# Altium schematic sheet supply.SchDoc
size A; SheetNumber: 2; SheetTotal: 3
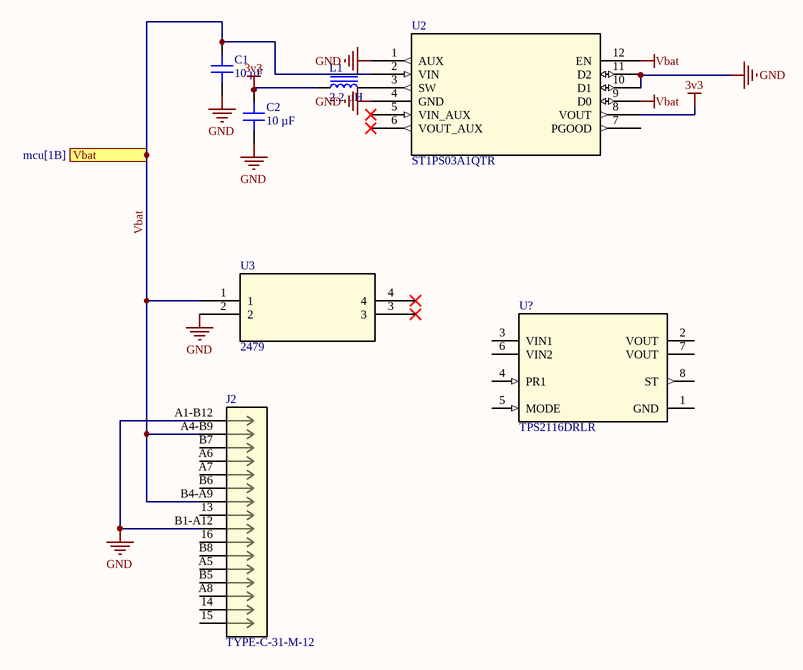
[diagram p0: supply.SchDoc]

## Parts
C1  10 µF  [CAP 0402_1005]
C2  10 µF  [CAP 0402_1005]
J2  TYPE-C-31-M-12  [CONN12_C-31-M-12_HRO]
L1  2.2 µH  [TDK VLS201612CX]
U2  ST1PS03A1QTR  [TQFN12_2X1P7_STM]
U3  2479  [2479PCB_37P49X52P63_KEY]
U?  TPS2116DRLR  [DRL0008A-MFG]

## Ports
Vbat (see mcu[1B])

## Nets
3v3: C2.1 L1.1 U2.8(VOUT)
GND: C1.2 C2.2 J2.A1-B12 J2.B1-A12 U2.1(AUX) U2.4(GND) U2.10(D1) U2.11(D2) U3.2
Vbat: C1.1 J2.A4-B9 J2.B4-A9 U2.2(VIN) U2.9(D0) U2.12(EN) U3.1 ; port Vbat
NetL1_2: L1.2 U2.3(SW)

Not connected (* = marked no-connect by the designer): J2 13 14 15 16 A5 A6 A7 A8 B5 B6 B7 B8; U2 5(VIN_AUX)* 6(VOUT_AUX)* 7(PGOOD); U3 3* 4*; U? 1(GND) 2(VOUT) 3(VIN1) 4(PR1) 5(MODE) 6(VIN2) 7(VOUT) 8(ST)

## Library data of the parts
C1 C2 = C0402C104K7PAC7867: CAP CER 0.1UF 4V X5R 0402; manufacturer: KEMET; Capacitance: 0.1 µF; Tolerance: ±10%; Part Number: C0402C104K7PAC7867; Value: 10 µF; Applications: Bypass, Decoupling; componentlink1description: Datasheet; componentlink1url: https://api.kemet.com/component-edge/download/datasheet/C0402C104K7PAC7867.pdf; componentlink2description: DigiKey Link; componentlink2url: https://www.digikey.com/en/products/detail/kemet/C0402C104K7PAC7867/7381987; Device Package: 0402 (1005 Metric); lastupdated: 1/9/2022 12:30:40 pm; Lifecycle Status: Active; Minimum Order: 1; Mounting Type: Surface Mount, MLCC; Operating Temperature: -55°C ~ 85°C; Package / Case: 0402 (1005 Metric); packaging: TapeAndReel; partid: 5603; Part Status: Active; price: 0.01; series: SMD Comm X5R; Size / Dimension: 0.039" L x 0.020" W (1.00mm x 0.50mm); Supplier 1: DigiKey; Supplier Part Number 1: 399-14871-1-ND; Temperature Coefficient: X5R; Thickness (Max): 0.022" (0.55mm); Voltage - Rated: 4V
J2 = TYPE-C-31-M-12: No Description Available; Mfr_Name: HRO Electronics; RefDes: RefDes; Type: Type
L1 = VLS201612CX-6R8M-1: FIXED IND 6.8UH 930MA 368MOHM SM; Manufacturer: TDK Corporation; Current - Saturation: 730mA; DC Resistance (DCR): 368mOhm Max; Inductance: 6.8 µH; Inductance Frequency - Test: 1 MHz; Material - Core: Ferrite; Shielding: Shielded; Tolerance: ±20%; Type: Drum Core, Wirewound; Part Number: VLS201612CX-6R8M-1; ComponentLink1Description: Datasheet; ComponentLink1URL: https://product.tdk.com/info/en/catalog/datasheets/inductor_commercial_power_vls201612cx-1_en.pdf?ref_disty=digikey; ComponentLink2Description: DigiKey Link; ComponentLink2URL: https://www.digikey.com/en/products/detail/tdk-corporation/VLS201612CX-6R8M-1/5169771; Current Rating (Amps): 930 mA; Device Package: Nonstandard; Height - Seated (Max): 0.047" (1.20mm); LastUpdated: 11/9/2022 10:31:03 am; Lifecycle Status: Active; Minimum Order: 1; Mounting Type: Surface Mount; Operating Temperature: -40°C ~ 105°C; Package / Case: Nonstandard; Packaging: TapeAndReel; PartId: 207; Part Status: Active; Price: 0.13; Series: VLS-CX-1; Size / Dimension: 0.079" L x 0.063" W (2.00mm x 1.60mm); Supplier 1: DigiKey; Supplier Part Number 1: 445-172966-1-ND; Supplier Device Package: 2016; Value: 2.2 µH
U2 = ST1PS03A1QTR: No Description Available; Mfr_Name: STMicroelectronics; RefDes: RefDes; Type: Type
U3 = 2479: No Description Available; Mfr_Name: Keystone Electronics; RefDes: RefDes; Type: Type
U? = TPS2116DRLR: No Description Available; Mfr_Name: Texas Instruments; TYPE: TYPE; RefDes: RefDes